# Altium schematic sheet [8]-MODEM_MAIN.SchDoc
size A4
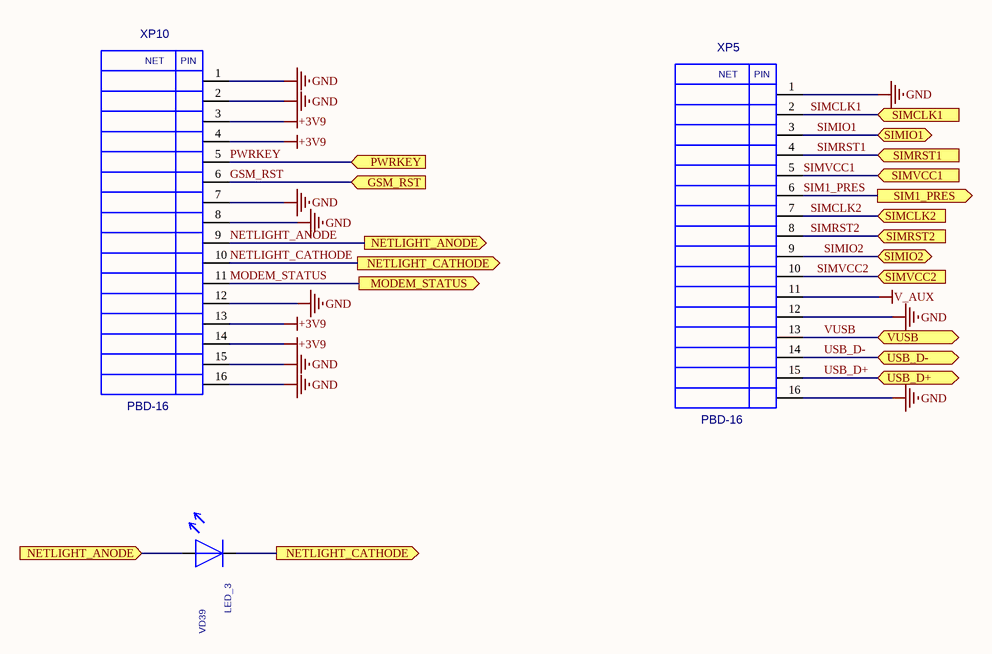
[diagram p0: [8]-MODEM_MAIN.SchDoc]

## Parts
VD39  LED_3  [LED3]
XP5  PBD-16  [PBD16]
XP10  PBD-16  [PBD16]

## Ports
GSM_RST (in), MODEM_STATUS (out), NETLIGHT_ANODE (in), NETLIGHT_ANODE (out), NETLIGHT_CATHODE (out), PWRKEY (in), SIM1_PRES (out), SIMCLK1 (in), SIMCLK2 (in), SIMIO1 (bidir), SIMIO2 (bidir), SIMRST1 (in), SIMRST2 (in), SIMVCC1 (in), SIMVCC2 (in), USB_D+ (bidir), USB_D- (bidir), VUSB (bidir)

## Nets
+3V9: XP10.3 XP10.4 XP10.13 XP10.14
GND: XP5.1 XP5.12 XP5.16 XP10.1 XP10.2 XP10.7 XP10.8 XP10.12 XP10.15 XP10.16
V_AUX: XP5.11
GSM_RST: XP10.6 ; port GSM_RST
MODEM_STATUS: XP10.11 ; port MODEM_STATUS
NETLIGHT_ANODE: VD39.2 XP10.9 ; port NETLIGHT_ANODE
NETLIGHT_CATHODE: VD39.1 XP10.10 ; port NETLIGHT_CATHODE
PWRKEY: XP10.5 ; port PWRKEY
SIM1_PRES: XP5.6 ; port SIM1_PRES
SIMCLK1: XP5.2 ; port SIMCLK1
SIMCLK2: XP5.7 ; port SIMCLK2
SIMIO1: XP5.3 ; port SIMIO1
SIMIO2: XP5.9 ; port SIMIO2
SIMRST1: XP5.4 ; port SIMRST1
SIMRST2: XP5.8 ; port SIMRST2
SIMVCC1: XP5.5 ; port SIMVCC1
SIMVCC2: XP5.10 ; port SIMVCC2
USB_D+: XP5.15 ; port USB_D+
USB_D-: XP5.14 ; port USB_D-
VUSB: XP5.13 ; port VUSB

## Notes on the sheet
- (in symbol PBD-16) NET; PIN

## Library data of the parts
VD39 = LED_3: Value: *
XP5 XP10 = PBD-16: Value: *